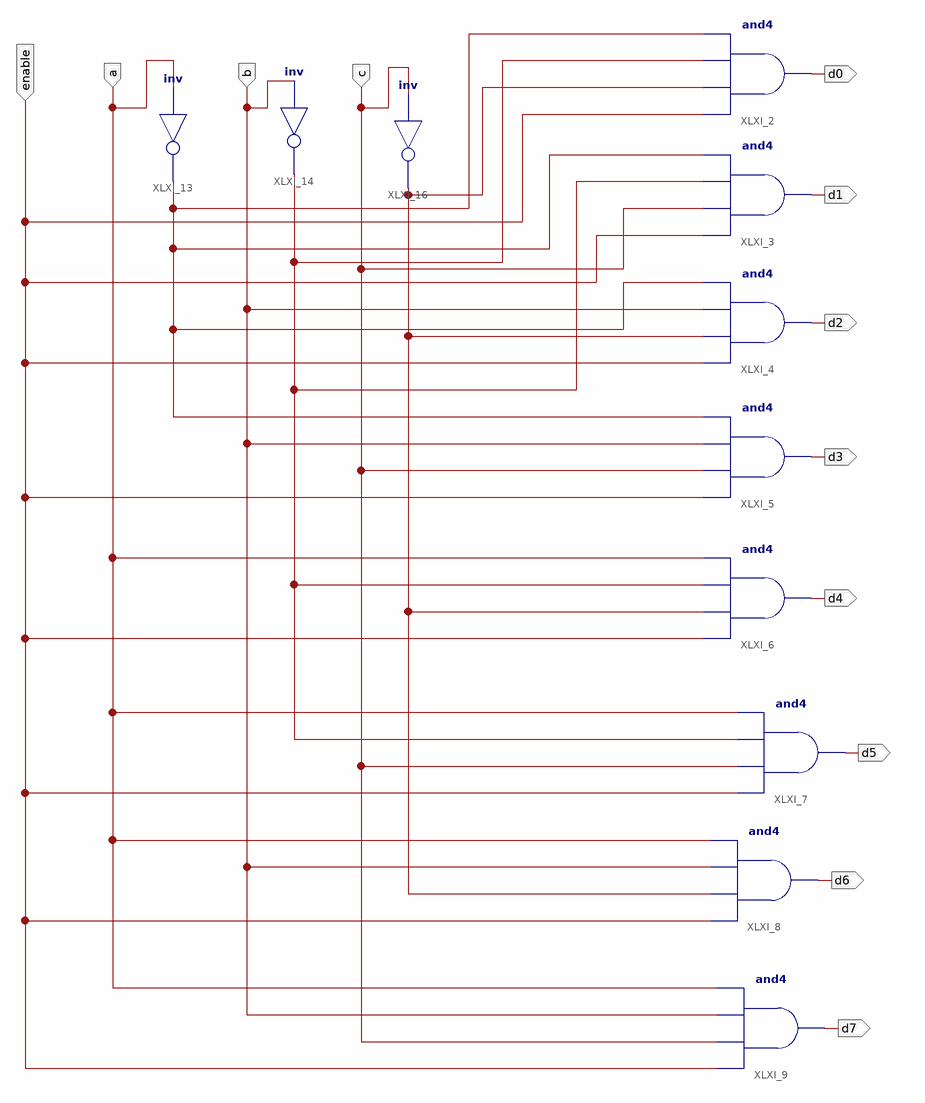
[diagram p0: schematic sheet 1]
// Xilinx ISE schematic sprinkler_circuit.sch (spartan3e) as structural Verilog: 11 symbols, 12 ports
module sprinkler_circuit (
  input  a,
  input  c,
  input  b,
  input  enable,
  output d2,
  output d3,
  output d4,
  output d6,
  output d5,
  output d7,
  output d0,
  output d1
);

  wire XLXN_41, XLXN_42, XLXN_52;

  and XLXI_4 (d2, enable, XLXN_52, b, XLXN_41);
  and XLXI_5 (d3, enable, c, b, XLXN_41);
  and XLXI_6 (d4, enable, XLXN_52, XLXN_42, a);
  and XLXI_8 (d6, enable, XLXN_52, b, a);
  not XLXI_13 (XLXN_41, a);
  not XLXI_14 (XLXN_42, b);
  not XLXI_16 (XLXN_52, c);
  and XLXI_7 (d5, enable, c, XLXN_42, a);
  and XLXI_9 (d7, enable, c, b, a);
  and XLXI_2 (d0, enable, XLXN_52, XLXN_42, XLXN_41);
  and XLXI_3 (d1, enable, c, XLXN_42, XLXN_41);
endmodule
